# EAGLE schematic OOBD - BTM182-BTM222 - V5 (EAGLE 5.11)
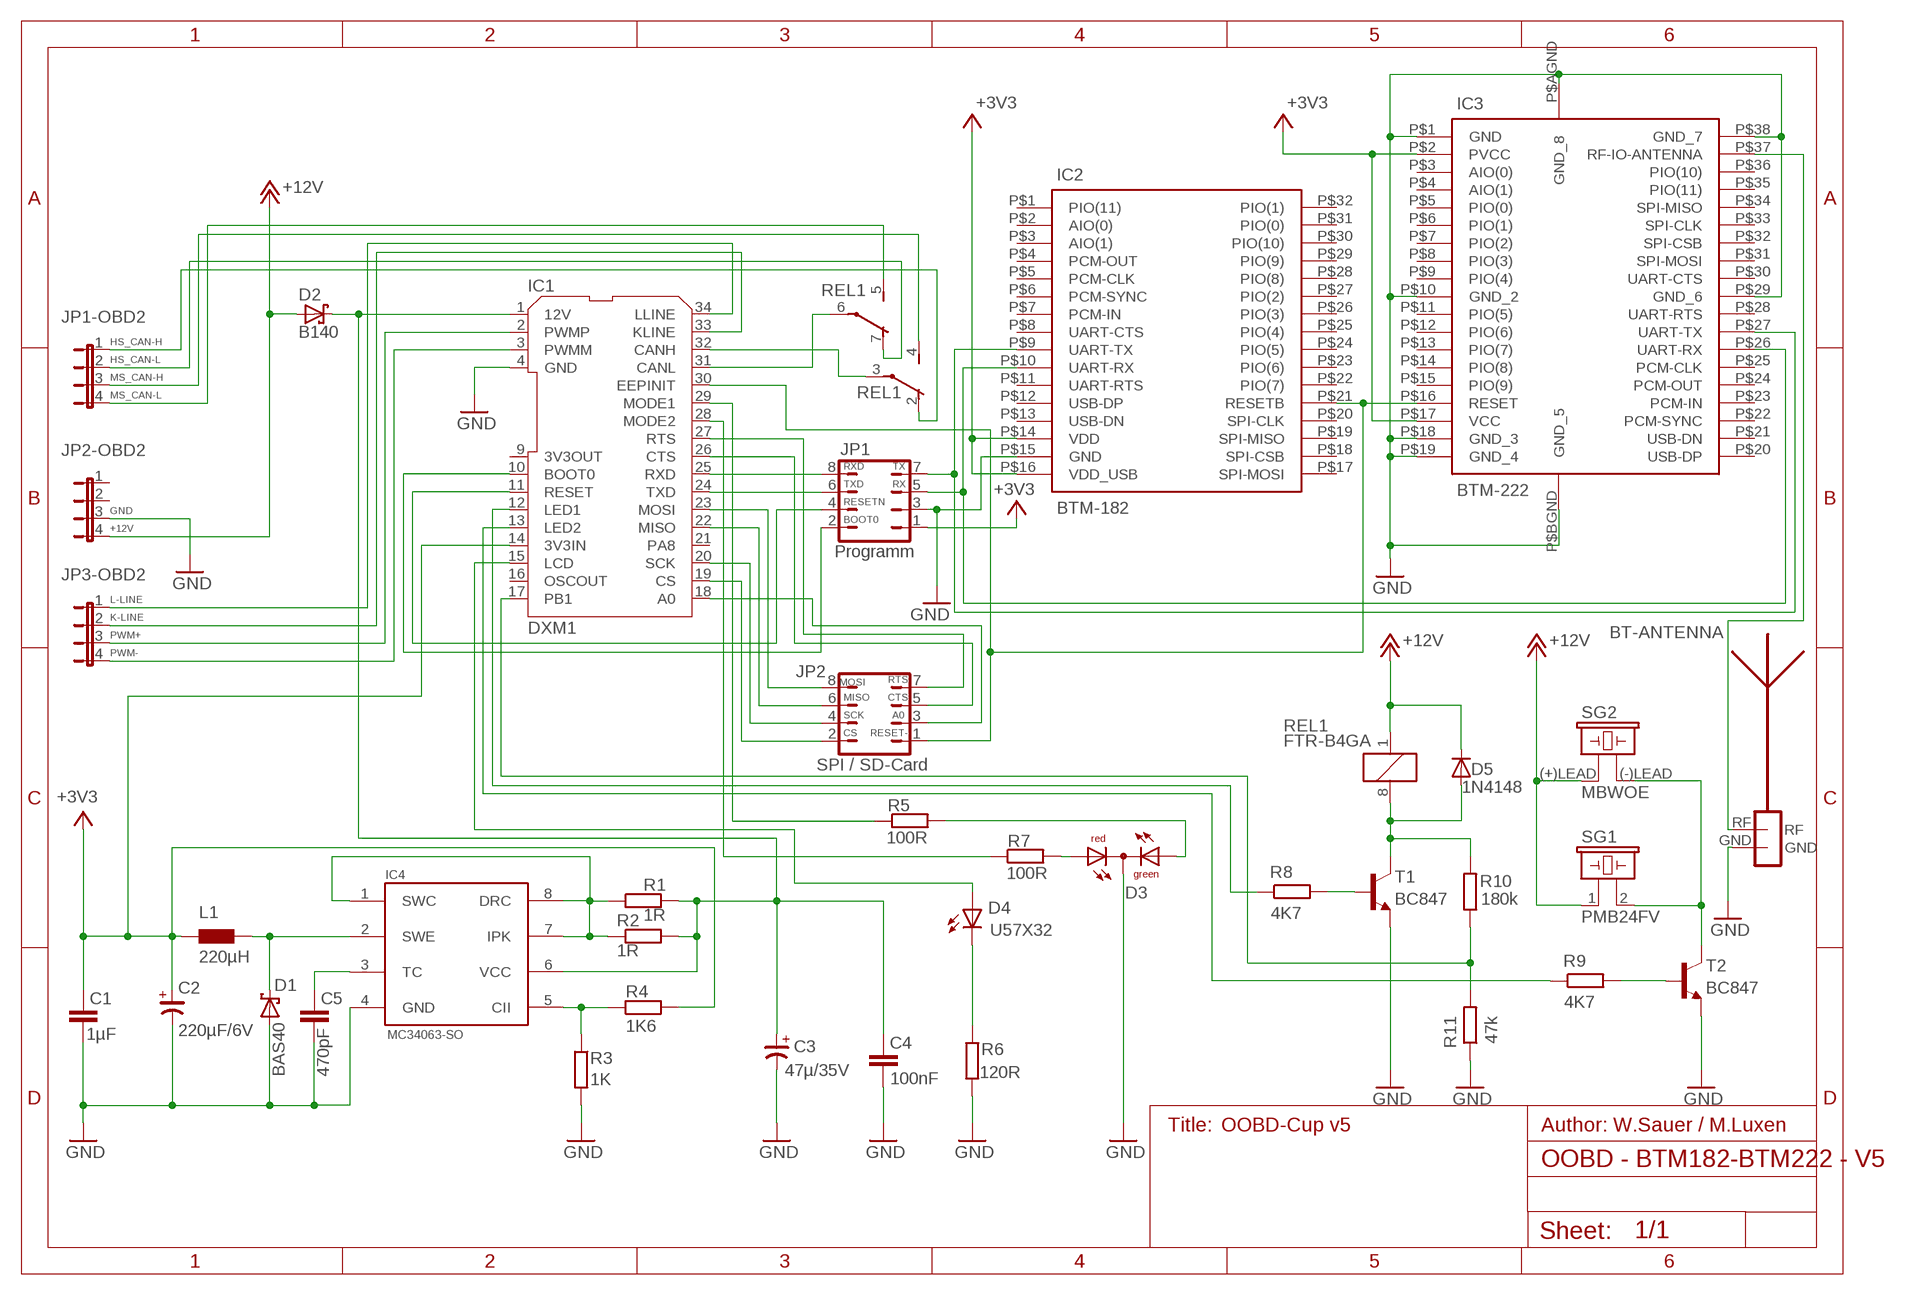
[diagram p0: schematic, sheet 1]

## Parts
BT-ANTENNA  ANTENNA_1RIGHT  [SWRA117D_RIGHT]
C1  1µF  C-EUC0603K  [C0603K]
C2  220µF/6V  CP_6032-TE-C  [C6032-TE-C]
C3  47µ/35V  CP-SV-D  [SV-D]
C4  100nF  C-EUC0603K  [C0603K]
C5  470pF  C-EUC0603K  [C0603K]
D1  BAS40  [SOT23]
D2  B140  SCHOTTKY-DIODESMD  [SMB]
D3  DUOLED2X5  [DUOLED2X5]
D4  U57X32  LEDSQR5.7X3.2  [U57X32]
D5  1N4148  DIODE-MICROMELF-W  [MICROMELF-W]
DXM1  IC1  DXM1-MINI  [DMX1-MINI]
IC2  BTM-182  [BTM-182]
IC3  BTM-222  [BTM-222]
IC4  MC34063-SO  [SO8]
JP1  Programm  JP4Q  [JP4Q]
JP1-OBD2  JP4E  [JP4]
JP2  SPI / SD-Card  JP4Q  [JP4Q]
JP2-OBD2  JP4E  [JP4]
JP3-OBD2  JP4E  [JP4]
L1  220µH  07HCP-XXXX-50  [07HCP-XXXX-50]
R1  1R  R-EU_R0603  [R0603]
R2  1R  R-EU_R0603  [R0603]
R3  1K  R-EU_R0603  [R0603]
R4  1K6  R-EU_R0603  [R0603]
R5  100R  R-EU_R0603  [R0603]
R6  120R  R-EU_R0603  [R0603]
R7  100R  R-EU_R0603  [R0603]
R8  4K7  R-EU_R0603  [R0603]
R9  4K7  R-EU_R0603  [R0603]
R10  180k  R-EU_R0603  [R0603]
R11  47k  R-EU_R0603  [R0603]
REL1  FTR-B4GA  [FTR-B4GA]
SG1  PMB24FV  [PMB24F/V]
SG2  MBWOE  [BME0603SA]
T1  BC847  [SOT23]
T2  BC847  [SOT23]

## Nets
12V_DOUT: C3.+ C4.1 D2.C DXM1.1(12V) IC4.6(VCC) R1.2 R2.2
+3V3: C1.1 C2.+ DXM1.14(3V3IN) IC2.P$14(VDD) IC2.P$16(VDD_USB) IC3.P$2(PVCC) IC3.P$17(VCC) JP1.1 L1.1 R4.2
+12V: D2.A D5.C JP2-OBD2.4 REL1.1 SG1.1 SG2.(+)LEAD
A0: DXM1.18(A0) JP2.3
BOOT0: DXM1.10(BOOT0) JP1.2
CS: DXM1.19(CS) JP2.2
CTS: DXM1.26(CTS) JP2.5
GND: BT-ANTENNA.GND C1.2 C2.- C3.- C4.2 C5.2 D1.1(A) D3.K(C) DXM1.4(GND) IC2.P$15(GND) IC3.P$1(GND) IC3.P$10(GND_2) IC3.P$18(GND_3) IC3.P$19(GND_4) IC3.P$29(GND_6) IC3.P$38(GND_7) IC3.P$AGND(GND_8) IC3.P$BGND(GND_5) IC4.4(GND) JP1.3 JP2-OBD2.3 R3.2 R6.2 R11.1 T1.2(E) T2.2(E)
HS_CAN-H: JP1-OBD2.1 REL1.2(O)
HS_CAN-L: JP1-OBD2.2 REL1.7(O)
K-LINE: DXM1.33(KLINE) JP3-OBD2.2
L-LINE: DXM1.34(LLINE) JP3-OBD2.1
MISO: DXM1.22(MISO) JP2.6
MODE1: DXM1.29(MODE1) R5.1
MODE2: DXM1.28(MODE2) R7.1
MOSI: DXM1.23(MOSI) JP2.8
MS_CAN-H: JP1-OBD2.3 REL1.4(S)
MS_CAN-L: JP1-OBD2.4 REL1.5(S)
N$1: IC4.5(CII) R3.1 R4.1
N$2: C5.1 IC4.3(TC)
N$4: D3.AR R7.2
N$5: IC4.1(SWC) IC4.7(IPK) IC4.8(DRC) R1.1 R2.1
N$6: D3.AG R5.2
N$7: D4.K(C) R6.1
N$8: D4.A DXM1.15(LCD)
N$19: DXM1.17(PB1) R10.1 R11.2
N$20: R8.2 T1.1(B)
N$21: DXM1.32(CANH) REL1.3(P)
N$22: DXM1.31(CANL) REL1.6(P)
N$23: SG1.2 SG2.(-)LEAD T2.3(C)
N$24: R9.2 T2.1(B)
N$25: DXM1.12(LED1) R8.1
N$26: DXM1.13(LED2) R9.1
N$27: D5.A R10.2 REL1.8 T1.3(C)
N$29: D1.3(C) IC4.2(SWE) L1.2
PWM+: DXM1.2(PWMP) JP3-OBD2.3
PWM-: DXM1.3(PWMM) JP3-OBD2.4
RESET-: DXM1.30(EEPINIT) IC2.P$21(RESETB) IC3.P$16(RESET) JP2.1
RESETN: DXM1.11(RESET) JP1.4
RF: BT-ANTENNA.RF IC3.P$37(RF-IO-ANTENNA)
RTS: DXM1.27(RTS) JP2.7
RX: IC2.P$10(UART-RX) IC3.P$26(UART-RX) JP1.5
RXD: DXM1.25(RXD) JP1.8
SCK: DXM1.20(SCK) JP2.4
TX: IC2.P$9(UART-TX) IC3.P$27(UART-TX) JP1.7
TXD: DXM1.24(TXD) JP1.6
Unconnected: DXM1.16(OSCOUT) DXM1.21(PA8) IC2.P$1(PIO(11)) IC2.P$2(AIO(0)) IC2.P$3(AIO(1)) IC2.P$4(PCM-OUT) IC2.P$5(PCM-CLK) IC2.P$6(PCM-SYNC) IC2.P$7(PCM-IN) IC2.P$8(UART-CTS) IC2.P$11(UART-RTS) IC2.P$12(USB-DP) IC2.P$13(USB-DN) IC2.P$17(SPI-MOSI) IC2.P$18(SPI-CSB) IC2.P$19(SPI-MISO) IC2.P$20(SPI-CLK) IC2.P$22(PIO(7)) IC2.P$23(PIO(6)) IC2.P$24(PIO(5)) IC2.P$25(PIO(4)) IC2.P$26(PIO(3)) IC2.P$27(PIO(2)) IC2.P$28(PIO(8)) IC2.P$29(PIO(9)) IC2.P$30(PIO(10)) IC2.P$31(PIO(0)) IC2.P$32(PIO(1)) IC3.P$3(AIO(0)) IC3.P$4(AIO(1)) IC3.P$5(PIO(0)) IC3.P$6(PIO(1)) IC3.P$7(PIO(2)) IC3.P$8(PIO(3)) IC3.P$9(PIO(4)) IC3.P$11(PIO(5)) IC3.P$12(PIO(6)) IC3.P$13(PIO(7)) IC3.P$14(PIO(8)) IC3.P$15(PIO(9)) IC3.P$20(USB-DP) IC3.P$21(USB-DN) IC3.P$22(PCM-SYNC) IC3.P$23(PCM-IN) IC3.P$24(PCM-OUT) IC3.P$25(PCM-CLK) IC3.P$28(UART-RTS) IC3.P$30(UART-CTS) IC3.P$31(SPI-MOSI) IC3.P$32(SPI-CSB) IC3.P$33(SPI-CLK) IC3.P$34(SPI-MISO) IC3.P$35(PIO(11)) IC3.P$36(PIO(10)) JP2-OBD2.1 JP2-OBD2.2

## Notes on the sheet
- Title: | OOBD-Cup v5 | Author: W.Sauer / M.Luxen

## Power pins joined to a net without a drawn wire
3V3OUT: DXM1.9(3V3OUT)

## Library data of the parts
BT-ANTENNA = ant-planar-1:ANTENNA_1
C1 C4 C5 = rcl:C-EU: CAPACITOR, European symbol
C2 = rc-master:CP_: POLARIZED CAP
C3 = cap-master:CP-: POLARIZED CAP
D1 = diode:BAS40: Silicon Schottky Diodes General-purpose diode for high-speed switching
D2 = diode:SCHOTTKY-DIODE: Schottky Diode
D3 = led:DUOLED2X5: DUO LED 2 colors, 2.5 x 5 mm, recangle
D4 = led:LED: LED OSRAM: - CHIPLED LG R971, LG N971, LY N971, LG Q971, LY Q971, LO R971, LY R971 LH N974, LH R974 LS Q976, LO Q976, LY Q976 LO Q996 - Hyper CHIPLED LW Q18S LB Q993, LB Q99A, LB R99A - SideLED LS A670, LO A670, LY A670, LG A670, LP A670 LB A673, LV A673, LT A673, LW A673 LH A674 LY A675 LS A676, LA A676, LO A676, LY A676, LW A676 LS A679, LY A679, LG A679 - Hyper Micro SIDELED® LS Y876, LA Y876, LO Y876, LY Y876 LT Y87S - SmartLED LW L88C, LW L88S LB L89C, LB L89S, LG L890 LS L89K, LO L89K, LY L89K LS L896, LA L896, LO L896, LY L896 - TOPLED LS T670, LO T670, LY T670, LG T670, LP T670 LSG T670, LSP T670, LSY T670, LOP T670, LYG T670 LG T671, LOG T671, LSG T671 LB T673, LV T673, LT T673, LW T673 LH T674 LS T676, LA T676, LO T676, LY T676, LB T676, LH T676, LSB T676, LW T676 LB T67C, LV T67C, LT T67C, LS T67K, LO T67K, LY T67K, LW E67C LS E67B, LA E67B, LO E67B, LY E67B, LB E67C, LV E67C, LT E67C LW T67C LS T679, LY T679, LG T679 LS T770, LO T770, LY T770, LG T770, LP T770 LB T773, LV T773, LT T773, LW T773 LH T774 LS E675, LA E675, LY E675, LS T675 LS T776, LA T776, LO T776, LY T776, LB T776 LHGB T686 LT T68C, LB T68C - Hyper Mini TOPLED® LB M676 - Mini TOPLED Santana® LG M470 LS M47K, LO M47K, LY M47K Source: http://www.osram.convergy.de LUXEON: - LUMILED® LXK2-PW12-R00, LXK2-PW12-S00, LXK2-PW14-U00, LXK2-PW14-V00 LXK2-PM12-R00, LXK2-PM12-S00, LXK2-PM14-U00 LXK2-PE12-Q00, LXK2-PE12-R00, LXK2-PE12-S00, LXK2-PE14-T00, LXK2-PE14-U00 LXK2-PB12-K00, LXK2-PB12-L00, LXK2-PB12-M00, LXK2-PB14-N00, LXK2-PB14-P00, LXK2-PB14-Q00 LXK2-PR12-L00, LXK2-PR12-M00, LXK2-PR14-Q00, LXK2-PR14-R00 LXK2-PD12-Q00, LXK2-PD12-R00, LXK2-PD12-S00 LXK2-PH12-R00, LXK2-PH12-S00 LXK2-PL12-P00, LXK2-PL12-Q00, LXK2-PL12-R00 Source: www.luxeon.com KINGBRIGHT: KA-3528ASYC Source: www.kingbright.com
D5 = diode:DIODE-: DIODE
DXM1 = DXM:DXM1-MINI
IC2 = BTM182:BTM-182: Rayson BTM-182 Bluetooth Modul all Pins
IC3 = btm-222:BTM-222: Rayson BTM-222 Bluetooth Modul all Pins
IC4 = mc34063:MC34063-SO: DC/DC converter MC34063 in SO08.
JP1 JP2 = jumper:JP4Q: JUMPER
JP1-OBD2 JP2-OBD2 JP3-OBD2 = jumper:JP4E: JUMPER
L1 = Inductor-Fastron:07HCP-XXXX-50: Fastron 07HCP series (with tube) Plugable inductors (shielded) Source: http://www.fastrongroup.com
R1-R11 = rcl:R-EU_: RESISTOR, European symbol
REL1 = relay:FTR-B4: Fujitsu FTR-B4 Series Ultra Miniature 2-Poles 2A (SLIM PROFILE SIGNAL RELAY); MN: Fujitsu; MPN: FTR-B4GAxxxZ; OC_REICHELT: FTR-B4GA 12V
SG1 = buzzer:PMB24F: Super thin buzzer PMB24 F/V (Vertical); OC_CONRAD: Best.-Nr.: 752223 - 62 [Teilenummer: 185110]
SG2 = buzzer:MBWOE: Buzzer SMD Miniaturbuzzer; MF: Grewus
T1 T2 = transistor:BC847: NPN TRANSISTOR